# Altium project prototype.PrjPCB
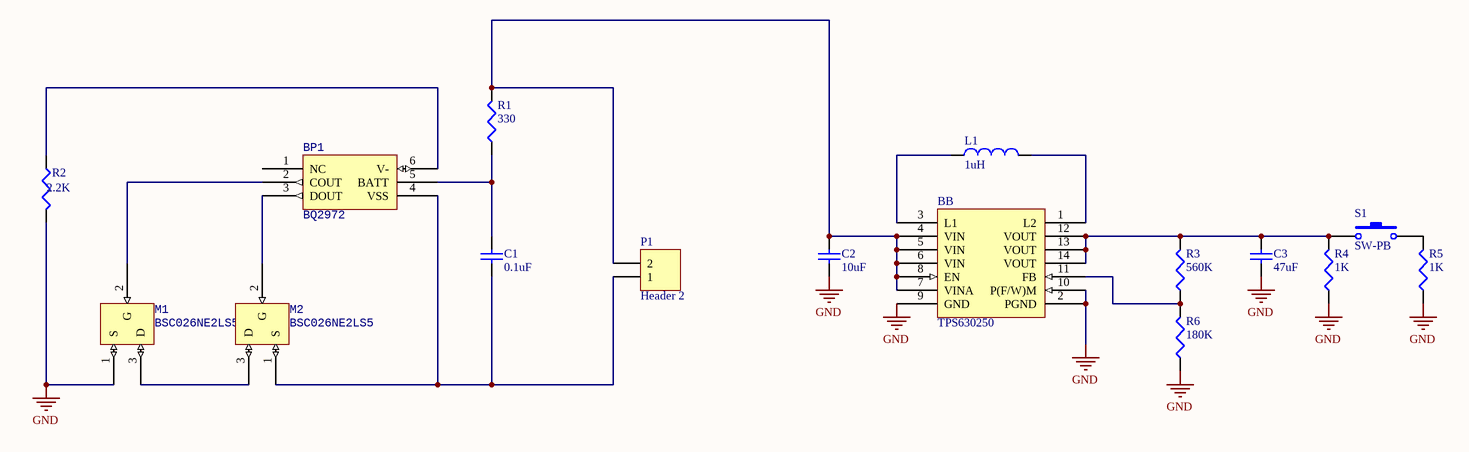
[diagram p0: Prototype.SchDoc]
1 sheet, 16 parts. Net scope: global (net labels, ports and power ports of the same name join across sheets).
Board file: prototype.PcbDoc

## Sheet Prototype.SchDoc
size A4

### Parts
BB  TPS630250  [RNC0014A]
BP1  BQ2972  [SON50P150X150X80-6N]
C1  0.1uF  [1608[0603]]
C2  10uF  [0603]
C3  47uF  [0603]
L1  1uH  [0402-A]
M1  BSC026NE2LS5  [INF-PG-TDSON-8-1_V]
M2  BSC026NE2LS5  [INF-PG-TDSON-8-1_V]
P1  Header 2  [HDR1X2]
R1  330  [J1-0603]
R2  2.2K  [J1-0603]
R3  560K  [J1-0603]
R4  1K  [J1-0603]
R5  1K  [J1-0603]
R6  180K  [J1-0603]
S1  SW-PB  [SPST-2]

### Nets
GND: BB.2(PGND) BB.9(GND) BB.10(P(F/W)M) C2.1 C3.1 M1.1(S) R2.2 R4.1 R5.1 R6.1
NetBB_1: BB.1(L2) L1.2
NetBB_3: BB.3(L1) L1.1
NetBB_4: BB.4(VIN) BB.5(VIN) BB.6(VIN) BB.7(VINA) BB.8(EN) C2.2 P1.2 R1.2
NetBB_11: BB.11(FB) R3.1 R6.2
NetBB_12: BB.12(VOUT) BB.13(VOUT) BB.14(VOUT) C3.2 R3.2 R4.2 S1.1
NetBP1_2: BP1.2(COUT) M1.2(G)
NetBP1_3: BP1.3(DOUT) M2.2(G)
NetBP1_4: BP1.4(VSS) C1.1 M2.1(S) P1.1
NetBP1_5: BP1.5(BATT) C1.2 R1.1
NetBP1_6: BP1.6(V-) R2.1
NetM1_3: M1.3(D) M2.3(D)
NetR5_2: R5.2 S1.2

Not connected (* = marked no-connect by the designer): BP1 1(NC)

### Library data of the parts
BB = TPS630250: Buck-boost converter
BP1 = BQ2972: Battery protection
C1-C3 = Cap: Capacitor; Published: 8-Jun-2000; LatestRevisionDate: 17-Jul-2002; LatestRevisionNote: Re-released for DXP Platform.; PackageReference: RAD-0.3; Publisher: Altium Limited; PackageDescription: Radial Cap, Thru-Hole; 2 Leads; 0.3 in Pin Spacing
  C1: Value: 0.1uF
  C2: Value: 10uF
  C3: Value: 47uF
L1 = Inductor: Code_IEC: 1005; Published: 8-Jun-2000; LatestRevisionDate: 29-May-2009; LatestRevisionNote: IPC-7351 Footprint Added.; PackageReference: 0402-A; Publisher: Altium Limited; PackageDescription: Chip Inductor; Code_JEITA: 0402; Value: 1uH
M1 M2 = BSC026NE2LS5: MOSFET
P1 = Header 2: Header, 2-Pin; LatestRevisionDate: 17-Jul-2002; LatestRevisionNote: Re-released for DXP Platform.; Publisher: Altium Limited
R1-R6 = Res3: Resistor; Published: 8-Jun-2000; LatestRevisionDate: 29-May-2009; LatestRevisionNote: IPC-7351 Footprint Added.; PackageReference: J1-0603; Publisher: Altium Limited; PackageDescription: Chip Resistor
  R1: Value: 330
  R2: Value: 2.2K
  R3: Value: 560K
  R4 R5: Value: 1K
  R6: Value: 180K
S1 = SW-PB: Switch; Published: 24-Mar-1999; LatestRevisionDate: 17-Jul-2002; LatestRevisionNote: Re-released for DXP Platform.; PackageReference: SPST-2; Publisher: Altium Limited; PackageDescription: Switch; 2 Leads